# EAGLE design Tachometer (EAGLE 6.4)
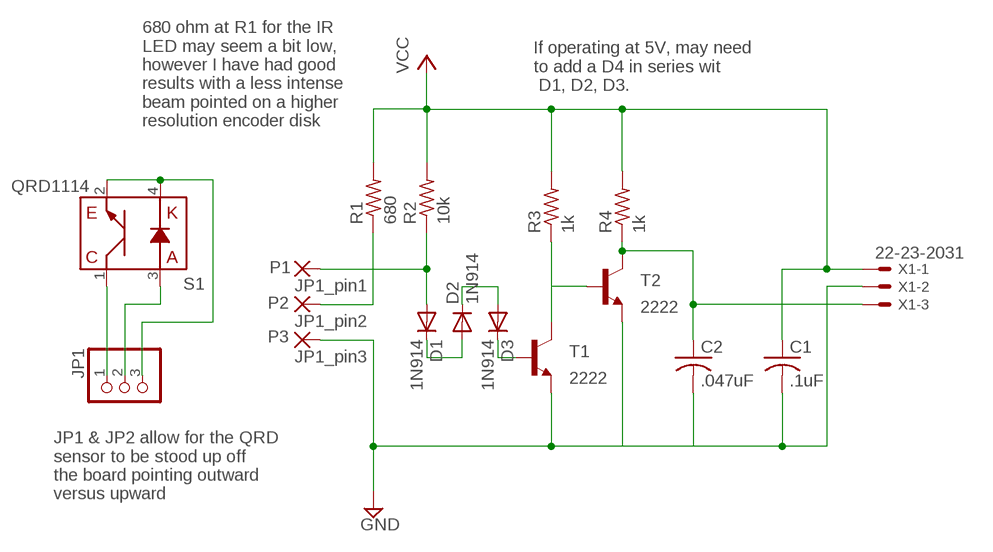
[diagram p0: schematic, sheet 1]

## Parts
C1  .1uF  C-US025-024X044  [C025-024X044]
C2  .047uF  C-US025-024X044  [C025-024X044]
D1  1N914  DIODE-D-2.5  [D-2.5]
D2  1N914  DIODE-D-2.5  [D-2.5]
D3  1N914  DIODE-D-2.5  [D-2.5]
JP1  PINHD-1X3/90  [1X03/90]
P1  JP1_pin1  1,6/0,9  [1,6/0,9]
P2  JP1_pin2  1,6/0,9  [1,6/0,9]
P3  JP1_pin3  1,6/0,9  [1,6/0,9]
R1  680  R-US_0204/5  [0204/5]
R2  10k  R-US_0204/5  [0204/5]
R3  1k  R-US_0204/5  [0204/5]
R4  1k  R-US_0204/5  [0204/5]
S1  QRD1114  [QRD1114]
T1  2222  -NPN-TO92-EBC  [TO92-EBC]
T2  2222  -NPN-TO92-EBC  [TO92-EBC]
X1  22-23-2031  [22-23-2031]

## Nets
GND: C1.2 C2.2 P3.1(P) T1.E T2.E X1.2
N$1: D1.A P1.1(P) R2.1
N$2: R3.1 T1.C T2.B
N$3: JP1.3 S1.2(C) S1.4(K)
N$4: JP1.2 S1.3(A)
N$5: JP1.1 S1.1(E)
N$6: P2.1(P) R1.1
N$7: D1.C D2.A
N$8: D2.C D3.A
N$9: D3.C T1.B
N$10: C2.1 R4.1 T2.C X1.3
VCC: C1.1 R1.2 R2.2 R3.2 R4.2 X1.1

## Notes on the sheet
- If operating at 5V, may need
  to add a D4 in series wit
   D1, D2, D3.
- 680 ohm at R1 for the IR
  LED may seem a bit low, 
  however I have had good
  results with a less intense
  beam pointed on a higher
  resolution encoder disk
- JP1 & JP2 allow for the QRD
  sensor to be stood up off
  the board pointing outward
  versus upward

## Library data of the parts
C1 C2 = resistor:C-US: CAPACITOR, American symbol
D1-D3 = diode:DIODE-: DIODE
JP1 = pinhead:PINHD-1X3: PIN HEADER
P1-P3 = wirepad:1,6/0,9: THROUGH-HOLE PAD
R1-R4 = resistor:R-US_: RESISTOR, American symbol
S1 = SparkFun-Sensors:QRD1114: Reflective object sensor
T1 T2 = transistor:*-NPN-: NPN Transistror BF959 corrected 2008.03.06
X1 = con-molex:22-23-2031: .100" (2.54mm) Center Header - 3 Pin; MF: MOLEX; MPN: 22-23-2031; OC_FARNELL: 1462950; OC_NEWARK: 30C0862

## Board
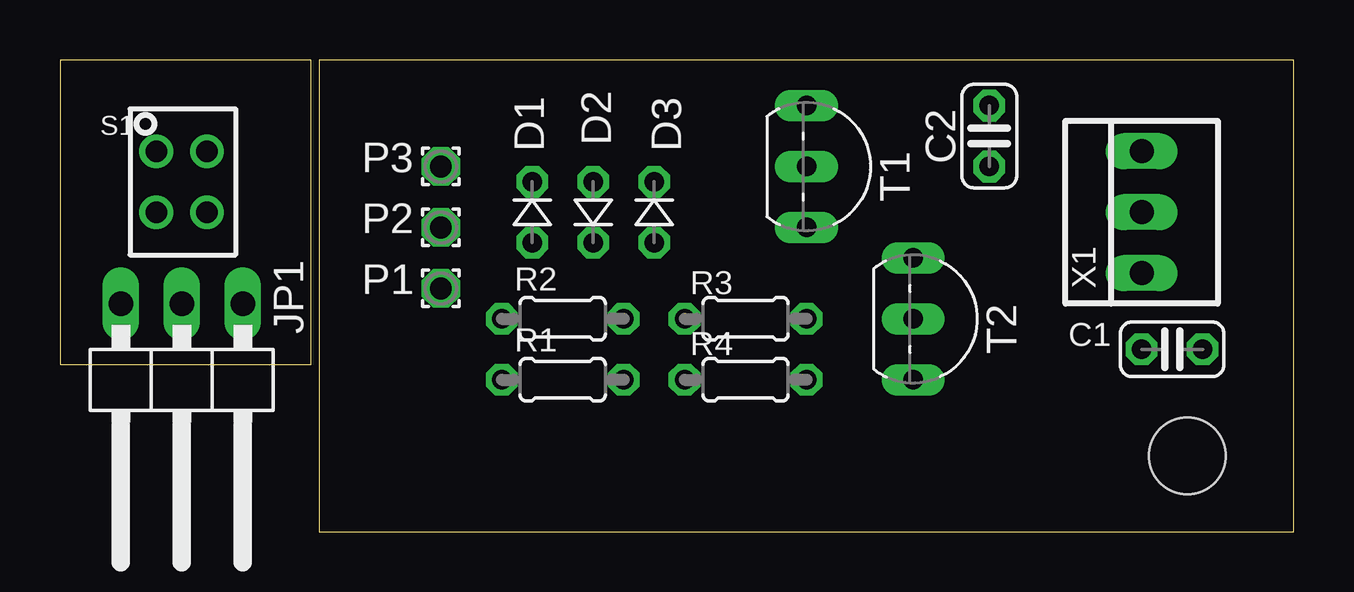
[diagram p1: board, top side]
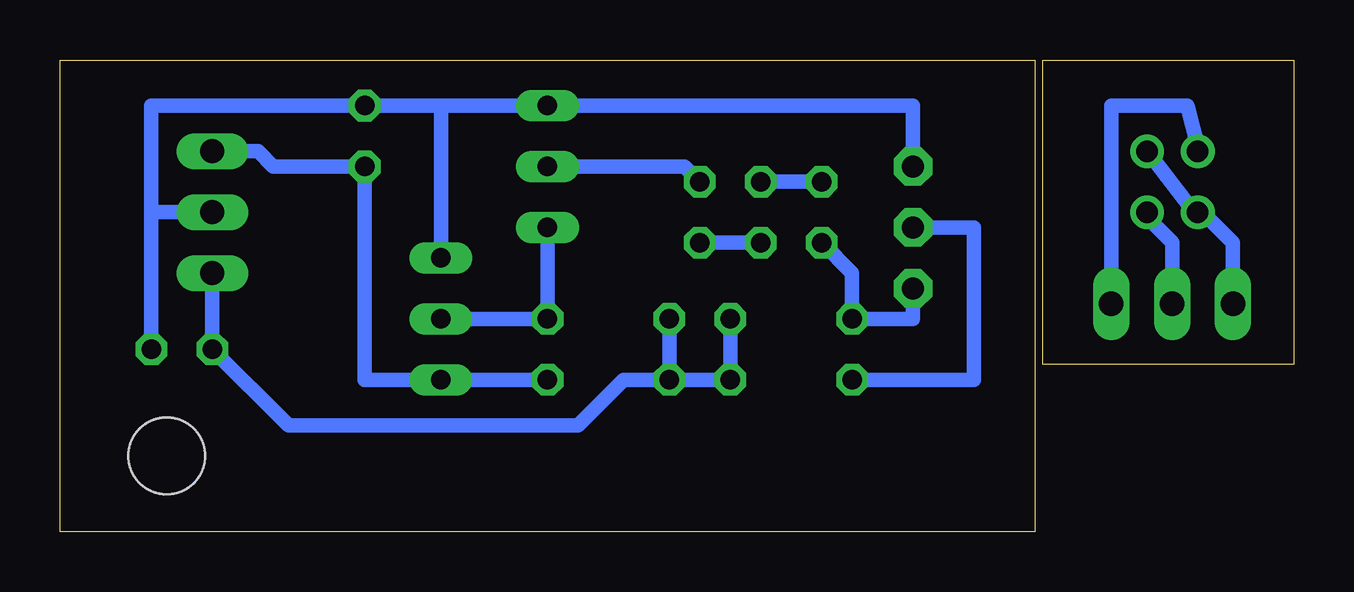
[diagram p2: board, bottom side, seen from below]

Size 51.44 x 19.68 mm. Coordinates in mm from the lower left corner, seen from the top.
Outline: 0,6.99 10.46,6.99 10.46,19.68 0,19.68 0,6.99
Outline: 10.79,19.68 10.79,0 51.44,0 51.44,19.68 10.79,19.68
Copper layers (1*16): Top 0.035mm / dielectric 1.5mm / Bottom 0.035mm
Design rules "default *": minimum track width 10mil, minimum drill 24mil, track to track 8mil, track to pad 8mil, pad to pad 8mil, via to via 8mil, smd to smd 8mil, copper to edge 40mil, drill to drill 8mil, minimum pad ring 10mil, minimum via ring 8mil, stop-mask expansion 0mil, vias tented up to drill 0mil, thermal gap 10mil
Holes 3.2 mm at 46.99,3.17

### Footprints (pad centres in the part's own frame; a part is rotated, then mirrored left to right if it is on the bottom)
C025-024X044 = drill 0.813 octagon: 1 -1.27,0; 2 1.27,0
D-2.5 = drill 0.813 octagon: A 1.27,0; C -1.27,0
1X03/90 = drill 1.016 long: 1 -2.54,-3.81; 2 0,-3.81; 3 2.54,-3.81
1,6/0,9 = drill 0.914 pad 1.6 octagon: 1 0,0
0204/5 = drill 0.813 octagon: 1 -2.54,0; 2 2.54,0
QRD1114 = drill 0.9: 1 -1.067,1.27; 2 -1.067,-1.27; 3 1.041,-1.27; 4 1.041,1.27
TO92-EBC = drill 0.813 long: B 0,-1.27; C 2.54,-1.27; E -2.54,-1.27
22-23-2031 = drill 1 long: 1 -2.54,0; 2 0,0; 3 2.54,0

### Placement (x,y rotation side)
C1  46.35,7.62 0 top
C2  38.73,16.51 90 top
D1  19.68,13.34 270 top
D2  22.23,13.34 90 top
D3  24.77,13.34 270 top
JP1  5.08,5.71 180 top
P1  15.88,10.16 0 top
P2  15.88,12.7 0 top
P3  15.88,15.24 0 top
R1  20.95,6.35 0 top
R2  20.95,8.89 0 top
R3  28.57,8.89 180 top
R4  28.57,6.35 180 top
S1  5.08,14.61 0 top
T1  32.38,15.24 270 top
T2  36.83,8.89 270 top
X1  45.09,13.34 90 top

### Tracks (layer width: path | path; a pad name or v marks a point on that pad's centre or on a via)
GND
  Bottom 0.61: 35.56,17.78 T1.E 15.88,17.78 P3.1 | 35.56,17.78 C2.2 47.62,17.78 47.62,13.34 | 47.62,13.34 X1.2 | C1.2 47.62,13.34 | T2.E 35.56,17.78
N$1
  Bottom 0.61: D1.A 18.41,10.79 R2.1 15.88,8.89 P1.1
N$2
  Bottom 0.61: T1.C R3.1 T2.B
N$3
  Bottom 0.61: S1.2 4.01,13.13 | 4.01,13.13 S1.4 | 4.01,13.13 3.61,13.13 2.54,12.06 JP1.3
N$4
  Bottom 0.61: S1.3 6.12,13.11 5.08,12.06 JP1.2
N$5
  Bottom 0.61: S1.1 4.01,16.08 4.45,17.78 7.62,17.78 JP1.1
N$6
  Bottom 0.61: R1.1 13.34,6.35 13.34,12.7 P2.1
N$7
  Bottom 0.61: D1.C D2.A
N$8
  Bottom 0.61: D2.C D3.A
N$9
  Bottom 0.61: D3.C 25.4,15.24 T1.B
N$10
  Bottom 0.61: R4.1 T2.C | T2.C 36.2,6.35 | T2.C 38.73,6.35 C2.1 42.55,15.24 43.18,15.88 X1.3
VCC
  Bottom 0.61: R2.2 R1.2 R4.2 | X1.1 C1.1 41.91,4.45 29.84,4.45 27.94,6.35 R4.2 | R3.2 R4.2

### Text on the board
tDocu: Tachometer - by: Morgan Demers